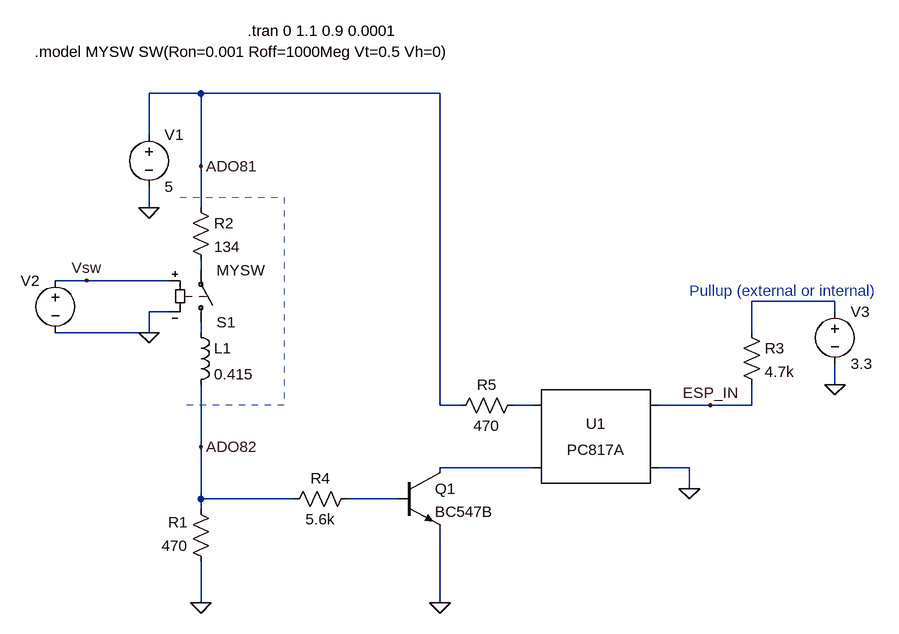
[diagram p0: schematic receiver.asc]
receiver.asc, the LTspice schematic file:
Version 4
SHEET 1 1192 680
WIRE 16 -144 -64 -144
WIRE 384 -144 16 -144
WIRE -64 -80 -64 -144
WIRE 16 -32 16 -144
WIRE -64 32 -64 0
WIRE 16 32 16 -32
WIRE 16 128 16 112
WIRE -160 144 -208 144
WIRE -32 144 -160 144
WIRE 992 176 864 176
WIRE -32 192 -64 192
WIRE 992 192 992 176
WIRE -64 224 -64 192
WIRE -64 224 -208 224
WIRE 16 224 16 208
WIRE 864 224 864 176
WIRE 992 304 992 272
WIRE 384 336 384 -144
WIRE 416 336 384 336
WIRE 528 336 496 336
WIRE 800 336 720 336
WIRE 864 336 864 304
WIRE 864 336 800 336
WIRE 16 400 16 304
WIRE 528 432 384 432
WIRE 768 432 720 432
WIRE 768 464 768 432
WIRE 16 480 16 400
WIRE 160 480 16 480
WIRE 320 480 240 480
WIRE 16 496 16 480
WIRE 16 640 16 576
WIRE 384 640 384 528
FLAG -64 224 0
FLAG -160 144 Vsw
FLAG -64 32 0
FLAG 16 640 0
FLAG 992 304 0
FLAG 384 640 0
FLAG 800 336 ESP_IN
FLAG 16 -32 ADO81
FLAG 16 400 ADO82
FLAG 768 464 0
SYMBOL sw 16 224 M180
SYMATTR InstName S1
SYMATTR Value MYSW
SYMBOL voltage -208 128 M0
WINDOW 3 24 96 Invisible 2
WINDOW 123 0 0 Left 0
WINDOW 39 0 0 Left 0
SYMATTR Value PWL(0 1 1 1 1.001 0 1.019 0 1.02 1 1.039 1 1.04 0 1.079 0 1.08 1)
SYMATTR InstName V2
SYMBOL voltage -64 -96 R0
WINDOW 123 0 0 Left 0
WINDOW 39 0 0 Left 0
SYMATTR InstName V1
SYMATTR Value 5
SYMBOL res 32 592 R180
WINDOW 0 36 76 Left 2
WINDOW 3 36 40 Left 2
SYMATTR InstName R1
SYMATTR Value 470
SYMBOL res 0 16 R0
SYMATTR InstName R2
SYMATTR Value 134
SYMBOL ind 0 208 R0
SYMATTR InstName L1
SYMATTR Value 0.415
SYMBOL voltage 992 176 R0
WINDOW 123 0 0 Left 0
WINDOW 39 0 0 Left 0
SYMATTR InstName V3
SYMATTR Value 3.3
SYMBOL res 848 208 R0
SYMATTR InstName R3
SYMATTR Value 4.7k
SYMBOL npn3 320 432 R0
SYMATTR InstName Q1
SYMATTR Value BC547B
SYMBOL res 256 464 R90
WINDOW 0 0 56 VBottom 2
WINDOW 3 32 56 VTop 2
SYMATTR InstName R4
SYMATTR Value 5.6k
SYMBOL Optos\\PC817A 624 384 R0
SYMATTR InstName U1
SYMBOL res 512 320 R90
WINDOW 0 0 56 VBottom 2
WINDOW 3 32 56 VTop 2
SYMATTR InstName R5
SYMATTR Value 470
TEXT 88 -240 Left 2 !.tran 0 1.1 0.9 0.0001
TEXT -240 -208 Left 2 !.model MYSW SW(Ron=0.001 Roff=1000Meg Vt=0.5 Vh=0)
TEXT 768 160 Left 2 ;Pullup (external or internal)
LINE Normal 144 336 -16 336 2
LINE Normal 144 16 144 336 2
LINE Normal -16 16 144 16 2

The netlist it stands for:
* receiver.asc
S1 N003 N001 Vsw 0 MYSW
V2 Vsw 0 PWL(0 1 1 1 1.001 0 1.019 0 1.02 1 1.039 1 1.04 0 1.079 0 1.08 1)
V1 ADO81 0 5
R1 0 ADO82 470
R2 ADO81 N001 134
L1 N003 ADO82 0.415
V3 N002 0 3.3
R3 N002 ESP_IN 4.7k
Q1 N005 N006 0 0 BC547B
R4 N006 ADO82 5.6k
XU1 N004 N005 ESP_IN 0 PC817 Igain=1m
R5 N004 ADO81 470
.model NPN NPN
.model PNP PNP
.lib standard.bjt
.tran 0 1.1 0.9 0.0001
.model MYSW SW(Ron=0.001 Roff=1000Meg Vt=0.5 Vh=0)
* Pullup (external or internal)
.lib PC817.sub
.backanno
.end